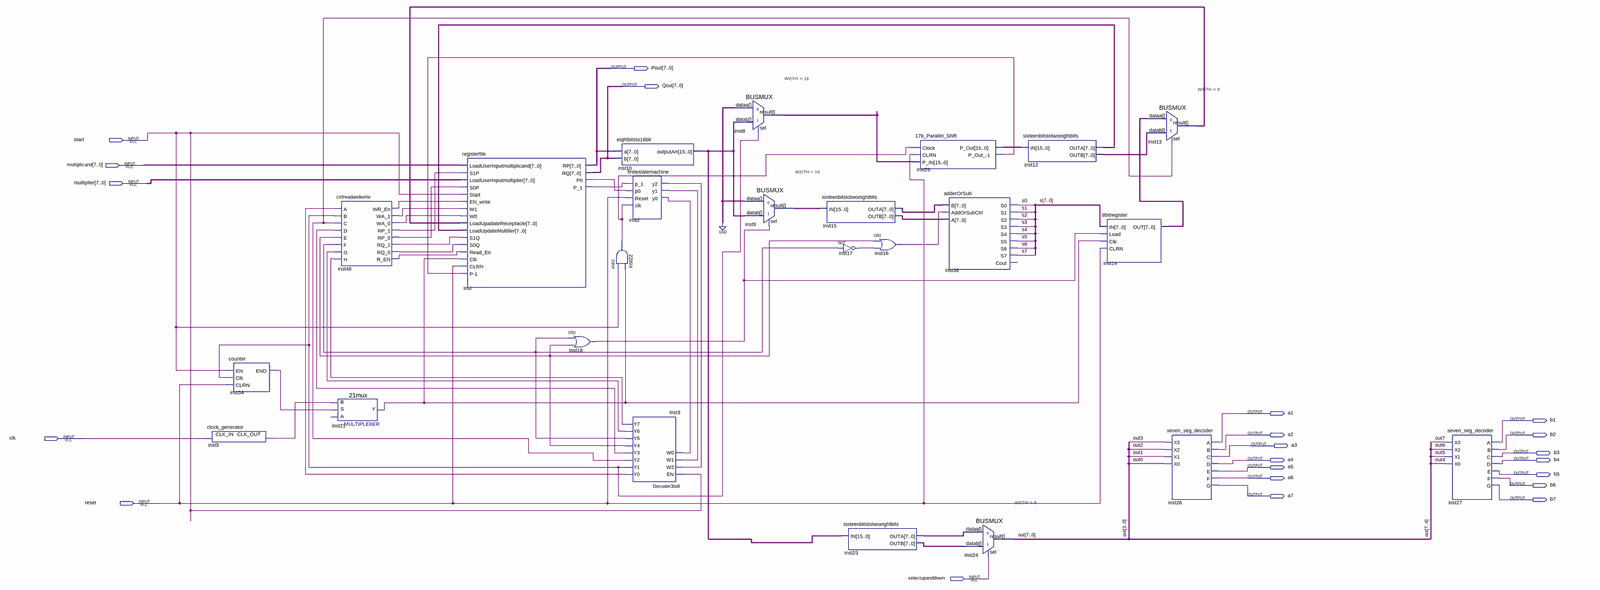
[diagram p0: schematic sheet, whole]
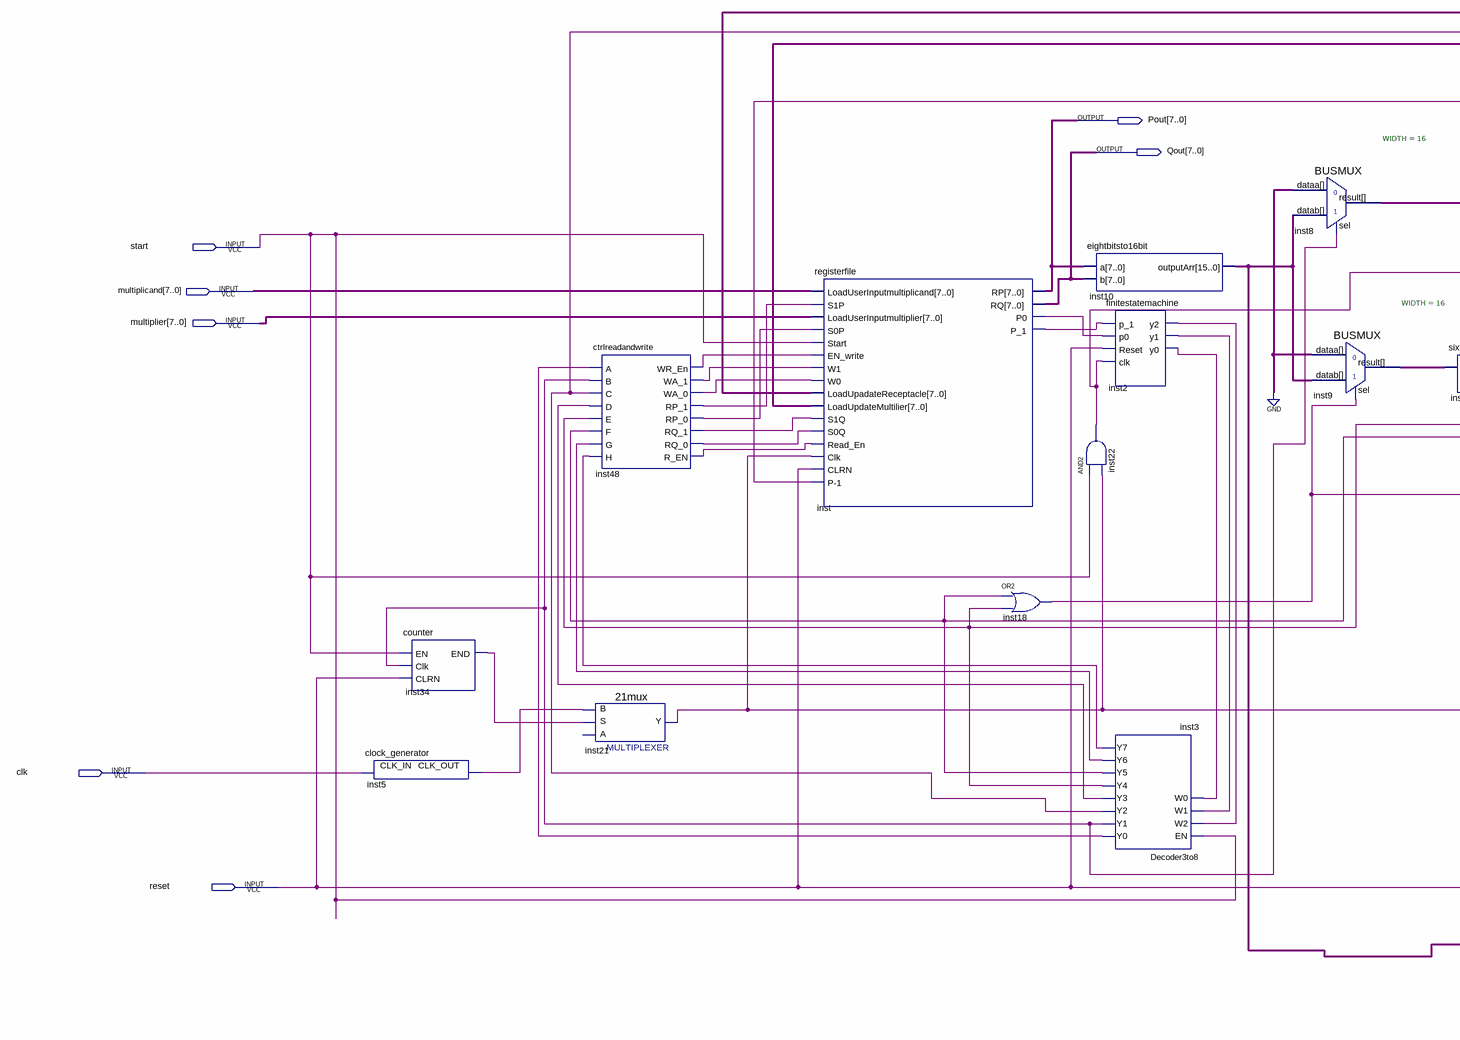
[diagram p1: schematic sheet, left part]
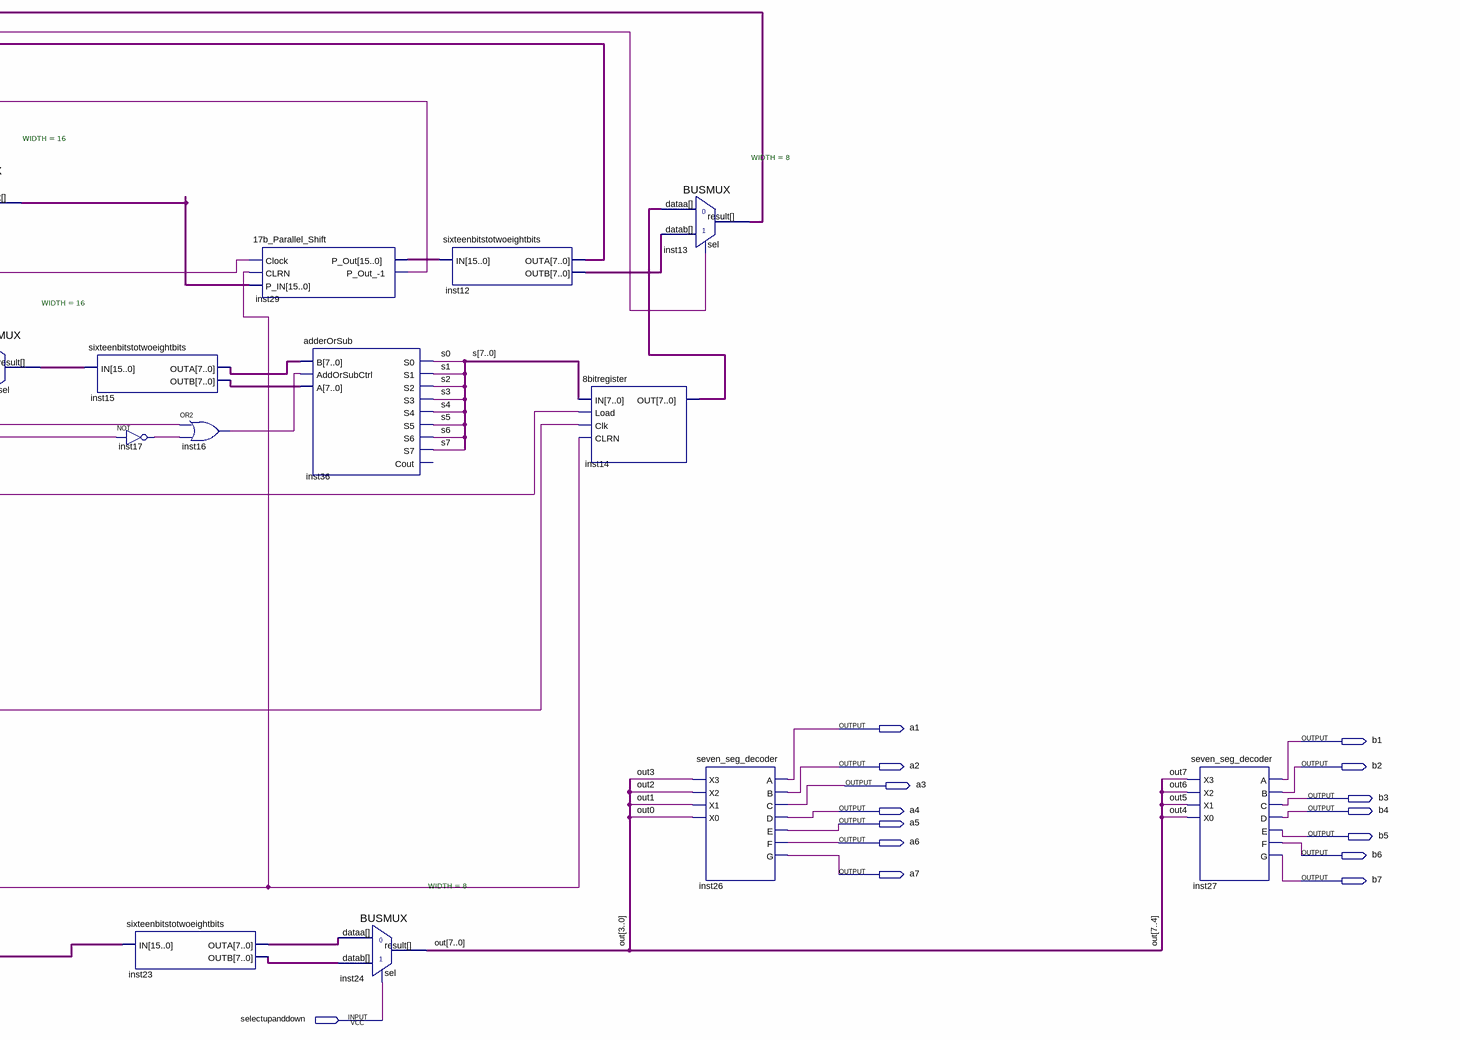
[diagram p2: schematic sheet, right part]
// Quartus schematic newfinal.bdf as structural Verilog: 24 symbols, 22 pins
module newfinal (
  input  start,
  input  [7:0] multiplicand,
  input  [7:0] multiplier,
  input  clk,
  input  reset,
  input  selectupanddown,
  output [7:0] Pout,
  output [7:0] Qout,
  output a1,
  output b1,
  output a2,
  output b2,
  output a3,
  output b3,
  output a4,
  output b4,
  output a5,
  output b5,
  output a6,
  output b6,
  output a7,
  output b7
);

  wire inst2_y0, inst2_y1, inst2_y2, inst3_y0, inst3_y1, inst3_y2, inst3_y3, inst3_y4, inst3_y5, inst3_y6,
       inst3_y7, inst5_clk_out, inst16_out, inst17_out, inst18_out, inst21_y, inst22_out, inst29_p_out__1,
       inst34_end, inst48_r_en, inst48_rp_0, inst48_rp_1, inst48_rq_0, inst48_rq_1, inst48_wa_0, inst48_wa_1,
       inst48_wr_en, inst_p0, inst_p_1;
  wire [7:0] inst12_outa, inst12_outb, inst13_result, inst14_out, inst15_outa, inst15_outb, inst23_outa,
       inst23_outb, out, s;
  wire [15:0] inst8_result, inst9_result, inst10_outputarr, inst29_p_out;

  clock_generator inst5 (.CLK_IN(clk), .CLK_OUT(inst5_clk_out));
  counter inst34 (.EN(start), .Clk(inst3_y1), .CLRN(reset), .END(inst34_end));
  ctrlreadandwrite inst48 (
    .A(inst3_y0), .B(inst3_y1), .C(inst3_y2), .D(inst3_y3), .E(inst3_y4), .F(inst3_y5), .G(inst3_y6),
    .H(inst3_y7), .WR_En(inst48_wr_en), .WA_1(inst48_wa_1), .WA_0(inst48_wa_0), .RP_1(inst48_rp_1),
    .RP_0(inst48_rp_0), .RQ_1(inst48_rq_1), .RQ_0(inst48_rq_0), .R_EN(inst48_r_en));
  \21mux  inst21 (.S(inst34_end), .B(inst5_clk_out), .Y(inst21_y));  // open: A
  registerfile inst (
    .LoadUserInputmultiplicand(multiplicand), .S1P(inst48_rp_1), .LoadUserInputmultiplier(multiplier),
    .S0P(inst48_rp_0), .Start(start), .EN_write(inst48_wr_en), .W1(inst48_wa_1), .W0(inst48_wa_0),
    .LoadUpadateReceptacle(inst13_result), .LoadUpdateMultilier(inst12_outa), .S1Q(inst48_rq_1),
    .S0Q(inst48_rq_0), .Read_En(inst48_r_en), .Clk(inst21_y), .CLRN(reset), .\P-1 (inst29_p_out__1),
    .RP(Pout), .RQ(Qout), .P0(inst_p0), .P_1(inst_p_1));
  or inst18 (inst18_out, inst3_y5, inst3_y4);
  and inst22 (inst22_out, start, inst21_y);
  eightbitsto16bit inst10 (.a(Pout), .b(Qout), .outputArr(inst10_outputarr));
  finitestatemachine inst2 (
    .p_1(inst_p_1), .p0(inst_p0), .Reset(reset), .clk(inst22_out), .y2(inst2_y2), .y1(inst2_y1), .y0(inst2_y0));
  Decoder3to8 inst3 (
    .EN(start), .W2(inst2_y2), .W1(inst2_y1), .W0(inst2_y0), .Y0(inst3_y0), .Y1(inst3_y1), .Y2(inst3_y2),
    .Y3(inst3_y3), .Y4(inst3_y4), .Y5(inst3_y5), .Y6(inst3_y6), .Y7(inst3_y7));
  BUSMUX #(.WIDTH(16)) inst8 (.datab(inst10_outputarr), .sel(inst3_y1), .dataa({16{1'b0}}), .result(inst8_result));
  BUSMUX #(.WIDTH(16)) inst9 (.datab(inst10_outputarr), .sel(inst18_out), .dataa({16{1'b0}}), .result(inst9_result));
  sixteenbitstotwoeightbits inst15 (.IN(inst9_result), .OUTA(inst15_outa), .OUTB(inst15_outb));
  not inst17 (inst17_out, inst3_y5);
  sixteenbitstotwoeightbits inst23 (.IN(inst10_outputarr), .OUTA(inst23_outa), .OUTB(inst23_outb));
  or inst16 (inst16_out, inst3_y4, inst17_out);
  \17b_Parallel_Shift  inst29 (
    .Clock(inst22_out), .CLRN(reset), .P_IN(inst8_result), .P_Out(inst29_p_out), .\P_Out_-1 (inst29_p_out__1));
  adderOrSub inst36 (
    .B(inst15_outa), .AddOrSubCtrl(inst16_out), .A(inst15_outb), .S0(s[0]), .S1(s[1]), .S2(s[2]), .S3(s[3]),
    .S4(s[4]), .S5(s[5]), .S6(s[6]), .S7(s[7]));  // open: Cout
  BUSMUX #(.WIDTH(8)) inst24 (.datab(inst23_outb), .sel(selectupanddown), .dataa(inst23_outa), .result(out));
  sixteenbitstotwoeightbits inst12 (.IN(inst29_p_out), .OUTA(inst12_outa), .OUTB(inst12_outb));
  \8bitregister  inst14 (.IN(s), .Load(inst18_out), .Clk(inst21_y), .CLRN(reset), .OUT(inst14_out));
  BUSMUX #(.WIDTH(8)) inst13 (.datab(inst12_outb), .sel(inst3_y2), .dataa(inst14_out), .result(inst13_result));
  seven_seg_decoder inst26 (
    .X3(out[3]), .X2(out[2]), .X1(out[1]), .X0(out[0]), .A(a1), .B(a2), .C(a3), .D(a4), .E(a5), .F(a6), .G(a7));
  seven_seg_decoder inst27 (
    .X3(out[7]), .X2(out[6]), .X1(out[5]), .X0(out[4]), .A(b1), .B(b2), .C(b3), .D(b4), .E(b5), .F(b6), .G(b7));
endmodule
